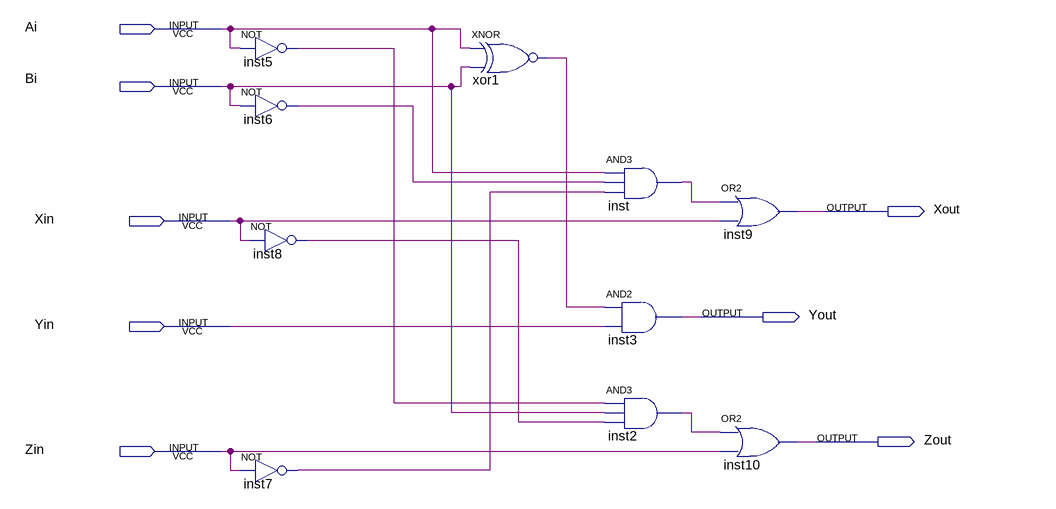
[diagram p0: schematic sheet]
// Quartus schematic Cmp1BitMAX.bdf as structural Verilog: 10 symbols, 8 pins
module Cmp1BitMAX (
  input  Ai,
  input  Bi,
  input  Xin,
  input  Yin,
  input  Zin,
  output Xout,
  output Yout,
  output Zout
);

  wire inst2_out, inst5_out, inst6_out, inst7_out, inst8_out, inst_out, xor1_out;

  not inst5 (inst5_out, Ai);
  not inst6 (inst6_out, Bi);
  not inst8 (inst8_out, Xin);
  not inst7 (inst7_out, Zin);
  xnor xor1 (xor1_out, Ai, Bi);
  and inst (inst_out, Ai, inst6_out, inst7_out);
  and inst3 (Yout, xor1_out, Yin);
  and inst2 (inst2_out, inst5_out, Bi, inst8_out);
  or inst9 (Xout, inst_out, Xin);
  or inst10 (Zout, inst2_out, Zin);
endmodule
